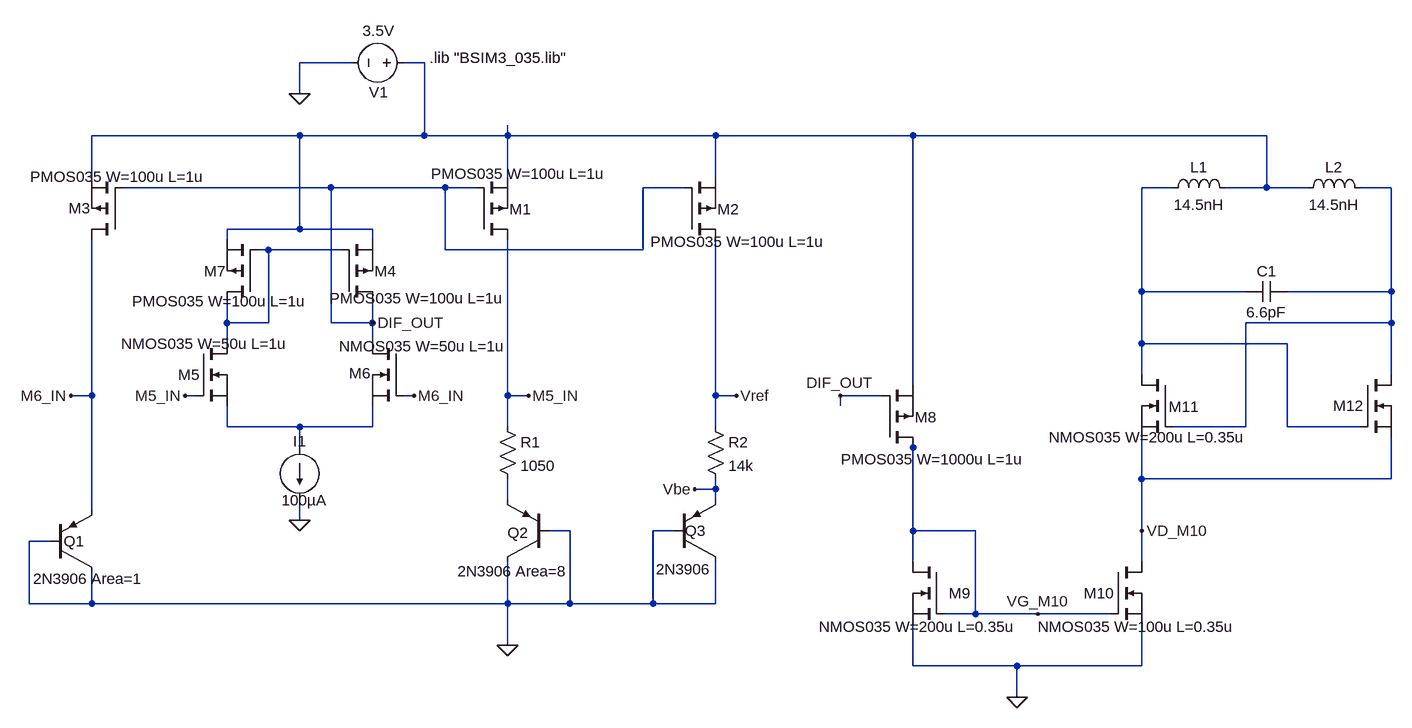
[diagram p0: schematic complete_schematic.asc]
complete_schematic.asc, the LTspice schematic file:
Version 4.1
SHEET 1 4728 900
WIRE 96 -288 16 -288
WIRE 208 -288 176 -288
WIRE 16 -240 16 -288
WIRE 16 -176 -304 -176
WIRE 208 -176 208 -288
WIRE 208 -176 16 -176
WIRE 336 -176 336 -192
WIRE 336 -176 208 -176
WIRE 656 -176 336 -176
WIRE 960 -176 656 -176
WIRE 1504 -176 960 -176
WIRE -304 -112 -304 -176
WIRE 336 -112 336 -176
WIRE 656 -112 656 -176
WIRE 64 -96 -256 -96
WIRE 240 -96 64 -96
WIRE 288 -96 240 -96
WIRE 608 -96 544 -96
WIRE 1360 -96 1312 -96
WIRE 1504 -96 1504 -176
WIRE 1504 -96 1440 -96
WIRE 1568 -96 1504 -96
WIRE 1696 -96 1648 -96
WIRE 16 -32 16 -176
WIRE 16 -32 -96 -32
WIRE 128 -32 16 -32
WIRE -96 -16 -96 -32
WIRE 128 -16 128 -32
WIRE -32 0 -48 0
WIRE 80 0 -32 0
WIRE 240 0 240 -96
WIRE 544 0 544 -96
WIRE 544 0 240 0
WIRE 1312 64 1312 -96
WIRE 1472 64 1312 64
WIRE 1696 64 1696 -96
WIRE 1696 64 1536 64
WIRE -96 112 -96 80
WIRE -32 112 -32 0
WIRE -32 112 -96 112
WIRE 64 112 64 -96
WIRE 128 112 128 80
WIRE 128 112 64 112
WIRE 1696 112 1696 64
WIRE 1696 112 1472 112
WIRE -96 144 -96 112
WIRE 128 144 128 112
WIRE 1312 144 1312 64
WIRE 1536 144 1312 144
WIRE 1312 192 1312 144
WIRE 1696 192 1696 112
WIRE 960 208 960 -176
WIRE -304 224 -304 -16
WIRE -304 224 -336 224
WIRE -144 224 -160 224
WIRE 192 224 176 224
WIRE 336 224 336 -16
WIRE 368 224 336 224
WIRE 656 224 656 -16
WIRE 688 224 656 224
WIRE 912 224 848 224
WIRE 848 240 848 224
WIRE -96 272 -96 240
WIRE 16 272 -96 272
WIRE 128 272 128 240
WIRE 128 272 16 272
WIRE 336 272 336 224
WIRE 656 272 656 224
WIRE 1472 272 1472 112
WIRE 1472 272 1360 272
WIRE 1536 272 1536 144
WIRE 1648 272 1536 272
WIRE 16 304 16 272
WIRE 960 304 960 288
WIRE 1312 352 1312 288
WIRE 1696 352 1696 288
WIRE 1696 352 1312 352
WIRE 656 368 656 352
WIRE 656 368 624 368
WIRE 336 384 336 352
WIRE 656 384 656 368
WIRE -304 400 -304 224
WIRE 16 416 16 384
WIRE 432 432 400 432
WIRE 592 432 560 432
WIRE 960 432 960 304
WIRE 1056 432 960 432
WIRE 1312 432 1312 352
WIRE -368 448 -400 448
WIRE 960 480 960 432
WIRE 1312 480 1312 432
WIRE -400 544 -400 448
WIRE -304 544 -304 496
WIRE -304 544 -400 544
WIRE 336 544 336 480
WIRE 336 544 -304 544
WIRE 432 544 432 432
WIRE 432 544 336 544
WIRE 560 544 560 432
WIRE 560 544 432 544
WIRE 656 544 656 480
WIRE 656 544 560 544
WIRE 1056 560 1056 432
WIRE 1056 560 1008 560
WIRE 1152 560 1056 560
WIRE 1264 560 1152 560
WIRE 336 608 336 544
WIRE 960 640 960 576
WIRE 1120 640 960 640
WIRE 1312 640 1312 576
WIRE 1312 640 1120 640
WIRE 1120 688 1120 640
FLAG 688 224 Vref
FLAG 368 224 M5_IN
FLAG -336 224 M6_IN
FLAG 624 368 Vbe
FLAG 128 112 DIF_OUT
FLAG 336 608 0
FLAG 16 416 0
FLAG 16 -240 0
FLAG 1120 688 0
FLAG 192 224 M6_IN
FLAG -160 224 M5_IN
FLAG 1312 432 VD_M10
FLAG 1152 560 VG_M10
FLAG 848 224 DIF_OUT
SYMBOL pnp -368 496 M180
WINDOW 0 21 48 Left 2
WINDOW 3 -26 -10 Left 2
SYMATTR InstName Q1
SYMATTR Value 2N3906 Area=1
SYMBOL pnp 400 480 R180
WINDOW 0 32 45 Left 2
WINDOW 3 -29 -14 Left 2
SYMATTR InstName Q2
SYMATTR Value 2N3906 Area=8
SYMBOL res 320 256 R0
SYMATTR InstName R1
SYMATTR Value 1050
SYMBOL pmos -256 -16 R180
WINDOW 0 50 48 Left 2
WINDOW 3 -127 97 Left 2
SYMATTR InstName M3
SYMATTR Value PMOS035 W=100u L=1u
SYMBOL res 640 256 R0
SYMATTR InstName R2
SYMATTR Value 14k
SYMBOL pnp 592 480 M180
WINDOW 0 17 48 Left 2
WINDOW 3 -28 -11 Left 2
SYMATTR InstName Q3
SYMATTR Value 2N3906
SYMBOL pmos 288 -16 M180
WINDOW 0 51 47 Left 2
WINDOW 3 -70 101 Left 2
SYMATTR InstName M1
SYMATTR Value PMOS035 W=100u L=1u
SYMBOL pmos 608 -16 M180
WINDOW 0 51 47 Left 2
WINDOW 3 -52 -3 Left 2
SYMATTR InstName M2
SYMATTR Value PMOS035 W=100u L=1u
SYMBOL pmos 80 80 M180
WINDOW 3 -18 6 Left 2
WINDOW 0 51 47 Left 2
SYMATTR Value PMOS035 W=100u L=1u
SYMATTR InstName M4
SYMBOL nmos -144 144 R0
WINDOW 0 -27 48 Left 2
WINDOW 3 -115 0 Left 2
SYMATTR InstName M5
SYMATTR Value NMOS035 W=50u L=1u
SYMBOL nmos 176 144 M0
WINDOW 0 50 46 Left 2
WINDOW 3 -159 4 Left 2
SYMATTR InstName M6
SYMATTR Value NMOS035 W=50u L=1u
SYMBOL pmos -48 80 R180
WINDOW 0 49 47 Left 2
WINDOW 3 -76 1 Left 2
SYMATTR InstName M7
SYMATTR Value PMOS035 W=100u L=1u
SYMBOL current 16 304 R0
WINDOW 3 -28 81 Left 2
WINDOW 123 0 0 Left 0
WINDOW 39 0 0 Left 0
WINDOW 0 -10 -10 Left 2
SYMATTR Value 100µA
SYMATTR InstName I1
SYMBOL pmos 912 304 M180
WINDOW 0 51 47 Left 2
WINDOW 3 -63 -18 Left 2
SYMATTR InstName M8
SYMATTR Value PMOS035 W=1000u L=1u
SYMBOL voltage 192 -288 R90
WINDOW 0 45 40 VRight 2
WINDOW 3 -49 30 VRight 2
WINDOW 123 0 0 Left 0
WINDOW 39 0 0 Left 0
SYMATTR InstName V1
SYMATTR Value 3.5V
SYMBOL ind 1344 -80 R270
WINDOW 0 32 56 VTop 2
WINDOW 3 5 56 VBottom 2
SYMATTR InstName L1
SYMATTR Value 14.5nH
SYMATTR SpiceLine Rser=10m
SYMBOL ind 1552 -80 R270
WINDOW 0 32 56 VTop 2
WINDOW 3 5 56 VBottom 2
SYMATTR InstName L2
SYMATTR Value 14.5nH
SYMATTR SpiceLine Rser=10m
SYMBOL cap 1536 48 R90
WINDOW 0 0 32 VBottom 2
WINDOW 3 32 32 VTop 2
SYMATTR InstName C1
SYMATTR Value 6.6pF
SYMATTR SpiceLine Rser=10m
SYMBOL nmos 1360 192 M0
WINDOW 0 -41 49 Left 2
WINDOW 3 -114 96 Left 2
SYMATTR InstName M11
SYMATTR Value NMOS035 W=200u L=0.35u
SYMBOL nmos 1648 192 R0
WINDOW 0 -41 48 Left 2
WINDOW 3 50 71 Invisible 2
SYMATTR InstName M12
SYMATTR Value NMOS035 W=200u L=0.35u
SYMBOL nmos 1008 480 M0
WINDOW 0 -41 48 Left 2
WINDOW 3 -112 100 Left 2
SYMATTR InstName M9
SYMATTR Value NMOS035 W=200u L=0.35u
SYMBOL nmos 1264 480 R0
WINDOW 0 -41 48 Left 2
WINDOW 3 -112 100 Left 2
SYMATTR InstName M10
SYMATTR Value NMOS035 W=100u L=0.35u
TEXT 216 -296 Left 2 !.lib "BSIM3_035.lib"

The netlist it stands for:
* complete_schematic.asc
Q1 0 0 M6_IN 0 2N3906 Area=1
Q2 0 0 N006 0 2N3906 Area=8
R1 M5_IN N006 1050
M3 M6_IN DIF_OUT N001 N001 PMOS035 W=100u L=1u
R2 Vref Vbe 14k
Q3 0 0 Vbe 0 2N3906
M1 M5_IN DIF_OUT N001 N001 PMOS035 W=100u L=1u
M2 Vref DIF_OUT N001 N001 PMOS035 W=100u L=1u
M4 DIF_OUT N004 N001 N001 PMOS035 W=100u L=1u
M5 N004 M5_IN N005 N005 NMOS035 W=50u L=1u
M6 DIF_OUT M6_IN N005 N005 NMOS035 W=50u L=1u
M7 N004 N004 N001 N001 PMOS035 W=100u L=1u
I1 N005 0 100µA
M8 VG_M10 DIF_OUT N001 N001 PMOS035 W=1000u L=1u
V1 N001 0 3.5V
L1 N002 N001 14.5nH Rser=10m
L2 N001 N003 14.5nH Rser=10m
C1 N003 N002 6.6pF Rser=10m
M11 N002 N003 VD_M10 VD_M10 NMOS035 W=200u L=0.35u
M12 N003 N002 VD_M10 VD_M10 NMOS035 W=200u L=0.35u
M9 VG_M10 VG_M10 0 0 NMOS035 W=200u L=0.35u
M10 VD_M10 VG_M10 0 0 NMOS035 W=100u L=0.35u
.model NPN NPN
.model PNP PNP
.lib standard.bjt
.model NMOS NMOS
.model PMOS PMOS
.lib standard.mos
.lib "BSIM3_035.lib"
.backanno
.end